# EAGLE schematic MotorIMUBoard (EAGLE 7.6.0)
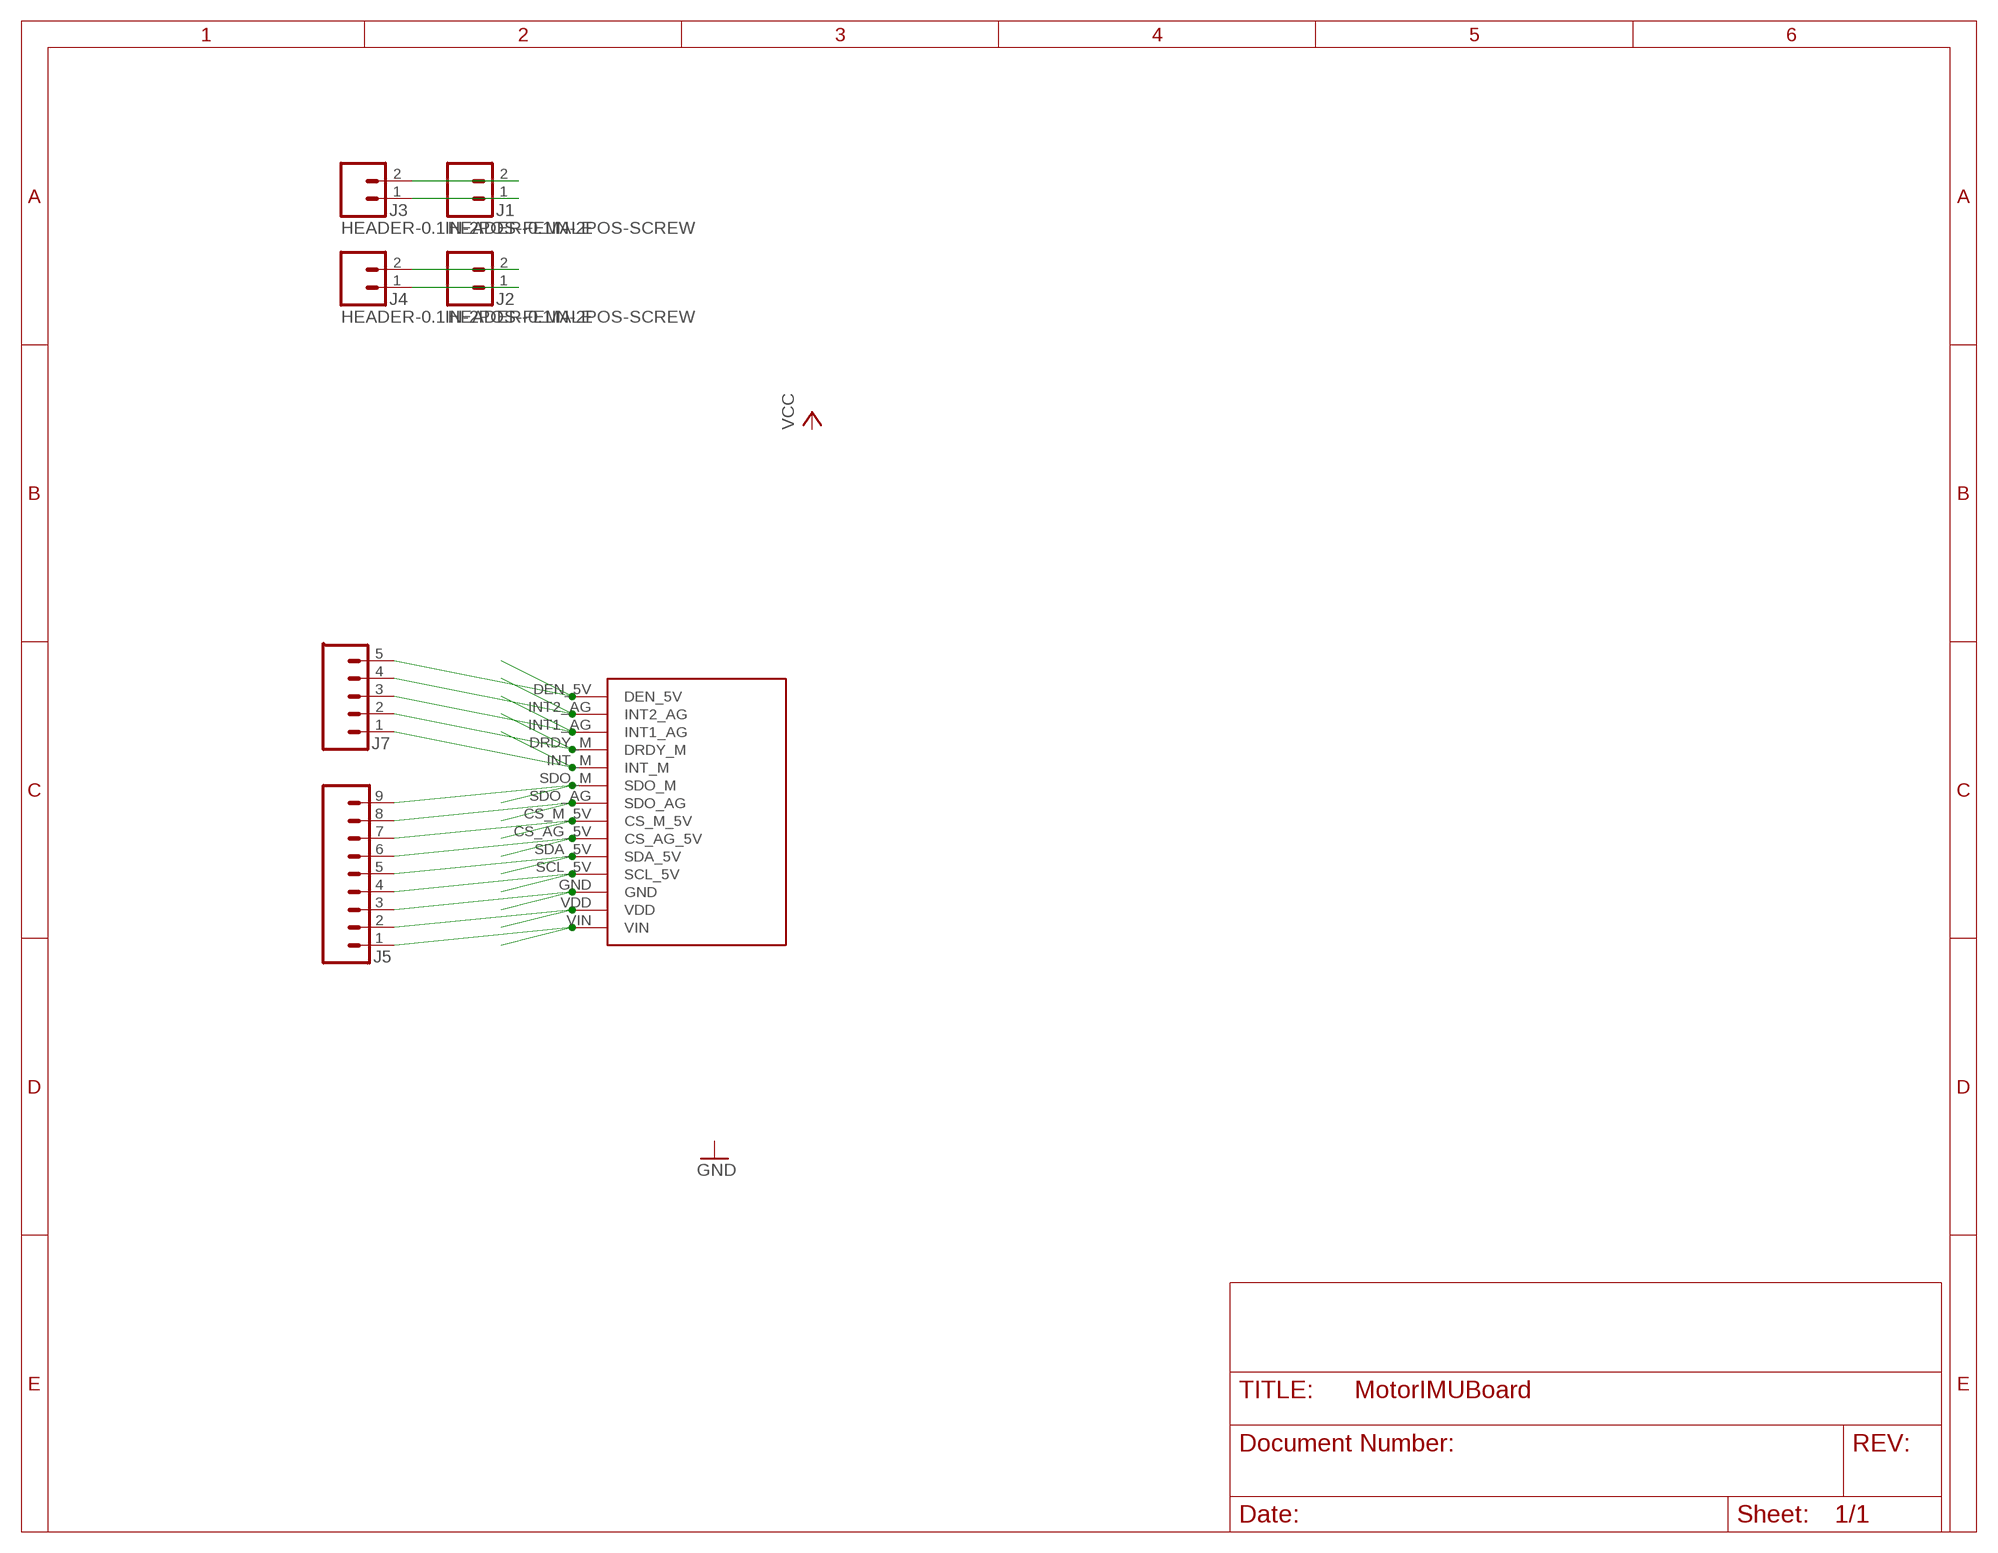
[diagram p0: schematic, sheet 1]

## Parts
J1  HEADER-0.1IN-2POS-SCREW  [SCREW-TERMINAL-1X2-2.54MM]
J2  HEADER-0.1IN-2POS-SCREW  [SCREW-TERMINAL-1X2-2.54MM]
J3  HEADER-0.1IN-2POS-FEMALE  [HDRV2W63P254_2X1_508X254H838_HS]
J4  HEADER-0.1IN-2POS-FEMALE  [HDRV2W63P254_2X1_508X254H838_HS]
J5  HEADER-0.1IN-9POS-FEMALE  [HDRV9W63P254_9X1_2286X254H838_HS]
J7  HEADER-0.1IN-5POS-FEMALE  [HDRV5W63P254_5X1_1270X254H838_HS]
U$1  ADAFRUIT-LSM9DS1-BOB  [ADAFRUIT-LSM9DS1]

## Nets
N$1: J2.1 J4.1
N$2: J2.2 J4.2
N$3: J1.1 J3.1
N$4: J1.2 J3.2
N$5: J5.1 U$1.VIN
N$6: J5.2 U$1.VDD
N$7: J5.3 U$1.GND
N$8: J5.4 U$1.SCL_5V
N$9: J5.5 U$1.SDA_5V
N$10: J5.6 U$1.CS_AG_5V
N$11: J5.7 U$1.CS_M_5V
N$12: J5.8 U$1.SDO_AG
N$13: J5.9 U$1.SDO_M
N$14: J7.1 U$1.INT_M
N$15: J7.2 U$1.DRDY_M
N$16: J7.3 U$1.INT1_AG
N$17: J7.4 U$1.INT2_AG
N$18: J7.5 U$1.DEN_5V

## Library data of the parts
J1 J2 = Components:HEADER-0.1IN-2POS: 2 pin single inline pin header, socket, or connector; DIST: digikey; DISTPN: ED10561-ND; PIN1: +; PIN2: -
J3 J4 = Components:HEADER-0.1IN-2POS: 2 pin single inline pin header, socket, or connector; DIST: Digikey; DISTPN: S7000-ND; PIN1: +; PIN2: -
J5 = Components:HEADER-0.1IN-9POS: 9 pin single inline pin header, socket, or connector; DIST: DIGIKEY; DISTPN: S7007-ND
J7 = Components:HEADER-0.1IN-5POS: 5 pin single inline pin header, socket, or connector; DIST: Digikey; DISTPN: S6103-ND; PIN1: 1; PIN2: 2; PIN3: 3; PIN4: 4; PIN5: 5
U$1 = BOBs:ADAFRUIT-LSM9DS1

## Net classes
1 HighAmps: width 0.762 mm